# Altium project L7S_TH_Full_v1.2.PrjPcb
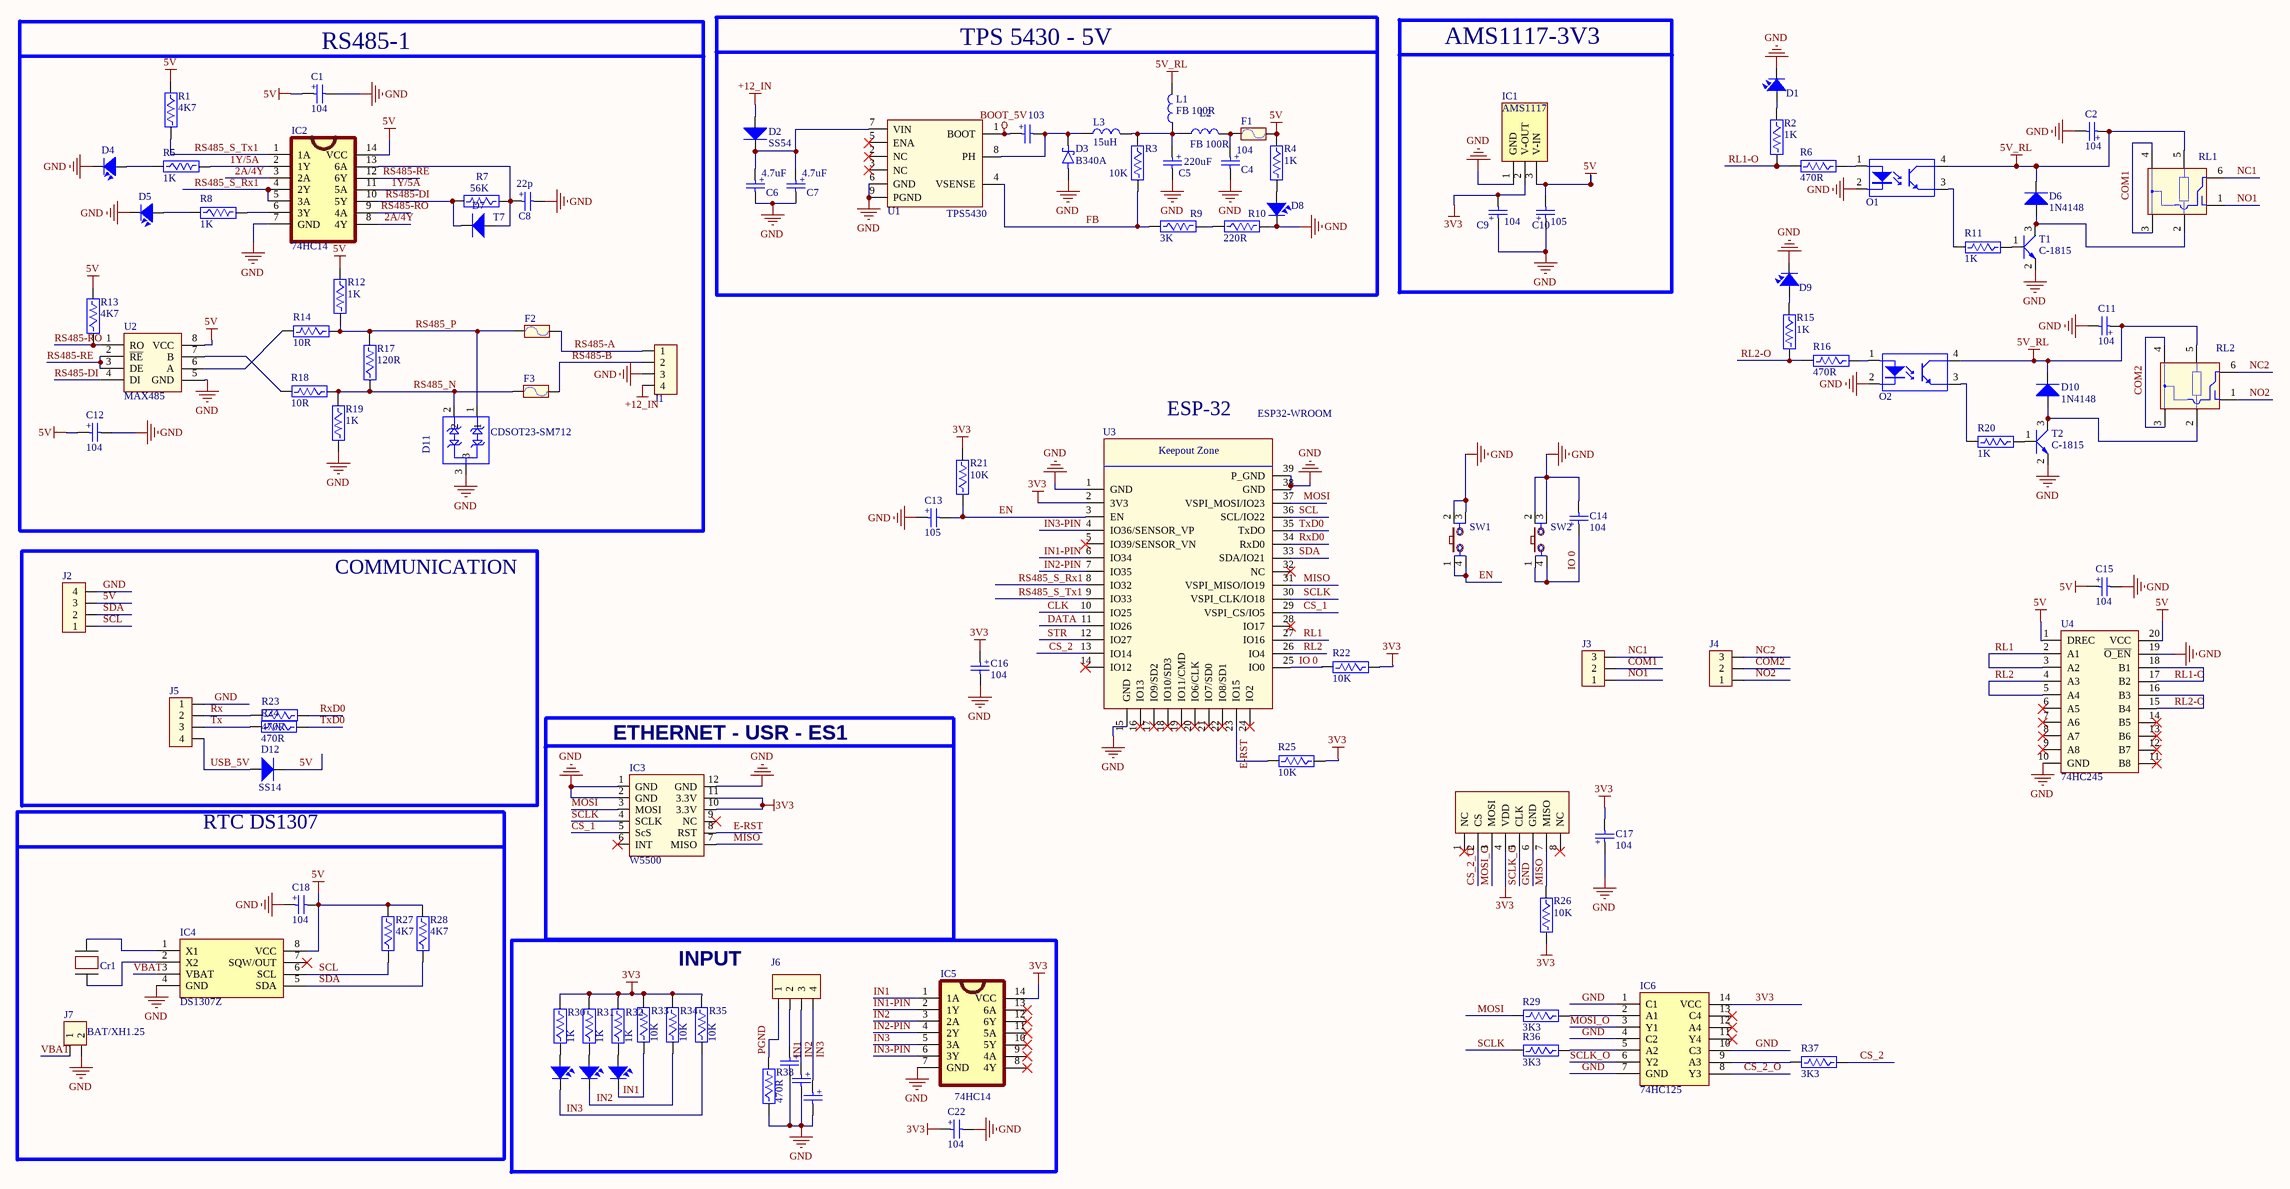
[diagram p0: Main.SchDoc]
2 sheets, 199 parts. Net scope: global (net labels, ports and power ports of the same name join across sheets).
Board file: L7S_TH_Full.PcbDoc
Sheets:
  Main.SchDoc
  LED.SchDoc

## Sheet Main.SchDoc
size A2; DocumentNumber: 1; SheetNumber: 1; SheetTotal: 2; Organization: Công ty cổ phần giải pháp và thiết bị VHB Việt Nam; Address1: KDT Dương Nội, Hà Đông, Hà Nội; SPICEModelCache: <root> / <DocumentId>GUMLTXHH</DocumentId> / </root>

### Parts
C1  104  [CAP 0805]
C2  104  [CAP 0805]
C3  103  [CAP 0805]
C4  104  [CAP 0805]
C5  220uF  [Capacitor 6x11]
C6  4.7uF  [CAP 0805]
C7  4.7uF  [CAP 0805]
C8  22p  [CAP 0805]
C9  104  [CAP 0805]
C10  105  [CAP 0805]
C11  104  [CAP 0805]
C12  104  [CAP 0805]
C13  105  [CAP 0805]
C14  104  [CAP 0805]
C15  104  [CAP 0805]
C16  104  [CAP 0805]
C17  104  [CAP 0805]
C18  104  [CAP 0805]
C19  104  [CAP 0805]  (value not drawn)
C20  104  [CAP 0805]  (value not drawn)
C21  104  [CAP 0805]  (value not drawn)
C22  104  [CAP 0805]
Cr1  FC135  [FC135327680KAAG0]  (value not drawn)
D1  LED RED 0805  [LED SMD 0805]  (value not drawn)
D2  SS54  [Diode SMB]
D3  B340A  [Diode Schotky]
D4  LED RED 0805  [LED SMD 0805]  (value not drawn)
D5  LED RED 0805  [LED SMD 0805]  (value not drawn)
D6  1N4148  [1N4848]
D7  T7  [Diode SMD]
D8  LED RED 0805  [LED SMD 0805]  (value not drawn)
D9  LED RED 0805  [LED SMD 0805]  (value not drawn)
D10  1N4148  [1N4848]
D11  M1_VALUE: CDSOT23-SM712  [SOT-23-3]  (hidden comment: SM712)
D12  SS14  [Diode SMB]
D13  LED RED 0805  [LED SMD 0805]  (value not drawn)
D14  LED RED 0805  [LED SMD 0805]  (value not drawn)
D15  LED RED 0805  [LED SMD 0805]  (value not drawn)
F1  Fuse 1812/6V  [fuse 1812]  (value not drawn)
F2  Fuse 0805/15V  [Fuse-0805]  (value not drawn)
F3  Fuse 0805/15V  [Fuse-0805]  (value not drawn)
IC1  ASM1117/3V3  [ASM1117]  (value not drawn)
IC2  74HC14  [SOP14]
IC3  W5500  [W5500-USR-ES1]
IC4  DS1307Z  [SOIC127P600X175-8N]
IC5  74HC14  [SOP14]
IC6  74HC125  [SOP65P640X120-14N]
J1  KF128-5.08-4P  [CON 4 KF128 5.08]  (value not drawn)
J2  XH2.54-4P-C  [XH-2.54 4P-T]  (value not drawn)
J3  KF128 5.08-3P  [CON KF128-3P]  (value not drawn)
J4  KF128 5.08-3P  [CON KF128-3P]  (value not drawn)
J5  XH2.54-4P-C  [XH-2.54 4P-C]  (value not drawn)
J6  KF128-5.08-4P  [CON 4 KF128 5.08]  (value not drawn)
J7  BAT/XH1.25  [Header 1.25]
L1  FB 100R  [L-Inductor 0805]
L2  FB 100R  [L-Inductor 0805]
L3  15uH  [Inductor CD75]
Mini_SDCard1  SD?  [Mini SDCard]  (value not drawn)
O1  EL3H7  [SOIC127P700X200-4N]  (value not drawn)
O2  EL3H7  [SOIC127P700X200-4N]  (value not drawn)
R1  4K7  [Res 0805]
R2  1K  [Res 0805]
R3  10K  [Res 0805]
R4  1K  [Res 0805]
R5  1K  [Res 0805]
R6  470R  [Res 0805]
R7  56K  [Res 0805]
R8  1K  [Res 0805]
R9  3K  [Res 0805]
R10  220R  [Res 0805]
R11  1K  [Res 0805]
R12  1K  [Res 0805]
R13  4K7  [Res 0805]
R14  10R  [Res 0805]
R15  1K  [Res 0805]
R16  470R  [Res 0805]
R17  120R  [Res 0805]
R18  10R  [Res 0805]
R19  1K  [Res 0805]
R20  1K  [Res 0805]
R21  10K  [Res 0805]
R22  10K  [Res 0805]
R23  470R  [Res 0805]
R24  470R  [Res 0805]
R25  10K  [Res 0805]
R26  10K  [Res 0805]
R27  4K7  [Res 0805]
R28  4K7  [Res 0805]
R29  3K3  [Res 0805]
R30  1K  [Res 0805]
R31  1K  [Res 0805]
R32  1K  [Res 0805]
R33  10K  [Res 0805]
R34  10K  [Res 0805]
R35  10K  [Res 0805]
R36  3K3  [Res 0805]
R37  3K3  [Res 0805]
R38  470R  [Res 0805]
RL1  Relay-HK4100F/12V  [HK4100FDC5VSHG]  (value not drawn)
RL2  Relay-HK4100F/12V  [HK4100FDC5VSHG]  (value not drawn)
SW1  SW  [SW2-SMD]  (value not drawn)
SW2  SW  [SW2-SMD]  (value not drawn)
T1  C-1815  [SOT23]
T2  C-1815  [SOT23]
U1  TPS5430  [SOIC127P600X170-9N]
U2  MAX485  [MAX485  SOP8]
U3  ESP32-WROOM  [ESP32WROOM32UEM113EH2800UH3Q0]
U4  74HC245  [74HC245-TSSOP20-4.4mm]

### Blocks framed on the sheet
RS485-1: C1 C8 C12 D4 D5 D7 D11 F2 F3 IC2 J1 R1 R5 R7 R8 R12-R14 R17-R19 U2
TPS 5430 - 5V: C3-C7 D2 D3 D8 F1 L1-L3 R3 R4 R9 R10 U1
AMS1117-3V3: C9 C10 IC1
COMMUNICATION: D12 J2 J5 R23 R24
ETHERNET - USR - ES1: IC3
RTC DS1307: C18 Cr1 IC4 J7 R27 R28
INPUT: C19-C22 D13-D15 IC5 J6 R30-R35 R38

### Nets
3V3: C9.2 C16.1 C17.2 C22.1 IC1.2(V-OUT) IC3.10(3.3V) IC3.11(3.3V) IC5.14(VCC) IC6.14(VCC) Mini_SDCard1.4(VDD) R21.2 R22.1 R25.1 R26.2 R30.2 R31.2 R32.2 R33.2 R34.2 R35.2 U3.2(3V3)
5V: C1.1 C10.2 C12.1 C15.1 C18.2 D12.2(K) F1.2 IC1.3(V-IN) IC2.14(VCC) IC4.8(VCC) J2.3 R1.1 R4.1 R12.1 R13.2 R27.2 R28.2 U2.8(VCC) U4.1(DREC) U4.20(VCC)
5V_RL: C2.1 C11.1 D6.K D10.K L1.2 O1.4(C) O2.4(C) RL1.5(COIL2) RL2.5(COIL2)
+12_IN: D2.1(A) J1.4
BOOT_5V: C3.1 U1.1(BOOT)
GND: C1.2 C2.2 C4.2 C5.2 C6.2 C7.2 C8.2 C9.1 C10.1 C11.2 C12.2 C13.1 C14.2 C15.2 C16.2 C17.1 C18.1 C19.2 C20.2 C21.2 C22.2 D1.2 D3.A D4.2 D5.2 D8.2 D9.2 D11.3 IC1.1(GND) IC2.7(GND) IC3.1(GND) IC3.2(GND) IC3.12(GND) IC4.4(GND) IC5.7(GND) IC6.1(C1) IC6.4(C2) IC6.7(GND) IC6.10(C3) J1.3 J2.4 J5.1 J7.2 Mini_SDCard1.6(GND) O1.2(K) O2.2(K) R10.2 R19.2 R38.1 SW1.2 SW1.3 SW2.2 SW2.3 T1.2(E) T2.2(E) U1.6(GND) U1.9(PGND) U2.5(GND) U3.1(GND) U3.15(GND) U3.38(GND) U3.39(P_GND) U4.10(GND) U4.19(~{O_EN})
1Y/5A: IC2.2(1Y) IC2.11(5A) R5.2
2A/4Y: IC2.3(2A) IC2.8(4Y)
CLK: U3.10(IO25)
COM1: J3.2 RL1.3(COM) RL1.4(COM)
COM2: J4.2 RL2.3(COM) RL2.4(COM)
CS_1: IC3.5(ScS) U3.29(VSPI_CS/IO5)
CS_2: R37.1 U3.13(IO14)
CS_2_O: IC6.8(Y3) Mini_SDCard1.2(CS)
DATA: U3.11(IO26)
E-RST: IC3.8(RST) R25.2 U3.23(IO15)
EN: C13.2 R21.1 SW1.1 SW1.4 U3.3(EN)
FB: R3.2 R9.1 U1.4(VSENSE)
IN1: C19.1 D15.2 IC5.1(1A) J6.2 R33.1
IN1-PIN: IC5.2(1Y) U3.6(IO34)
IN2: C20.1 D14.2 IC5.3(2A) J6.3 R34.1
IN2-PIN: IC5.4(2Y) U3.7(IO35)
IN3: C21.1 D13.2 IC5.5(3A) J6.4 R35.1
IN3-PIN: IC5.6(3Y) U3.4(IO36/SENSOR_VP)
IO 0: C14.1 R22.2 SW2.1 SW2.4 U3.25(IO0)
MISO: IC3.7(MISO) Mini_SDCard1.7(MISO) R26.1 U3.31(VSPI_MISO/IO19)
MOSI: IC3.3(MOSI) R29.2 U3.37(VSPI_MOSI/IO23)
MOSI_O: IC6.3(Y1) Mini_SDCard1.3(MOSI)
NC1: J3.3 RL1.6(NO)
NC2: J4.3 RL2.6(NO)
NO1: J3.1 RL1.1(NC)
NO2: J4.1 RL2.1(NC)
PGND: J6.1 R38.2
RL1: U3.27(IO16) U4.2(A1) U4.3(A2)
RL1-O: R2.2 R6.2 U4.17(B2) U4.18(B1)
RL2: U3.26(IO4) U4.4(A3) U4.5(A4)
RL2-O: R15.2 R16.2 U4.15(B4) U4.16(B3)
RS485-A: F2.2 J1.1
RS485-B: F3.2 J1.2
RS485-DI: D7.2(K) IC2.10(5Y) R7.2 U2.4(DI)
RS485-RE: IC2.12(6Y) U2.2(~{RE}) U2.3(DE)
RS485-RO: IC2.9(4A) R13.1 U2.1(RO)
RS485_N: D11.2 F3.1 R17.1 R18.1 R19.1
RS485_P: D11.1 F2.1 R12.2 R14.1 R17.2
RS485_S_Rx1: IC2.4(2Y) IC2.5(3A) U3.8(IO32)
RS485_S_Tx1: IC2.1(1A) R1.2 U3.9(IO33)
Rx: J5.2 R23.2
RxD0: R23.1 U3.34(RxD0)
SCL: IC4.6(SCL) J2.1 R27.1 U3.36(SCL/IO22)
SCLK: IC3.4(SCLK) R36.2 U3.30(VSPI_CLK/IO18)
SCLK_O: IC6.6(Y2) Mini_SDCard1.5(CLK)
SDA: IC4.5(SDA) J2.2 R28.1 U3.33(SDA/IO21)
STR: U3.12(IO27)
Tx: J5.3 R24.2
TxD0: R24.1 U3.35(TxDO)
USB_5V: D12.1(A) J5.4
VBAT: IC4.3(VBAT) J7.1
NetC3_2: C3.2 D3.K L3.1 U1.8(PH)
NetC4_1: C4.1 F1.1 L2.2
NetC5_1: C5.1 L1.1 L2.1 L3.2 R3.1
NetC6_1: C6.1 C7.1 D2.2(K) U1.7(VIN)
NetC8_1: C8.1 D7.1(A) IC2.13(6A) R7.1
NetCr1_1: Cr1.1 IC4.2(X2)
NetCr1_2: Cr1.2 IC4.1(X1)
NetD1_1: D1.1 R2.1
NetD4_1: D4.1 R5.1
NetD5_1: D5.1 R8.1
NetD6_A: D6.A RL1.2(COIL1) T1.3(C)
NetD8_1: D8.1 R4.2
NetD9_1: D9.1 R15.1
NetD10_A: D10.A RL2.2(COIL1) T2.3(C)
NetD13_1: D13.1 R30.1
NetD14_1: D14.1 R31.1
NetD15_1: D15.1 R32.1
NetIC2_6: IC2.6(3Y) R8.2
NetIC6_2: IC6.2(A1) R29.1
NetIC6_5: IC6.5(A2) R36.1
NetIC6_9: IC6.9(A3) R37.2
NetO1_1: O1.1(A) R6.1
NetO1_3: O1.3(E) R11.2
NetO2_1: O2.1(A) R16.1
NetO2_3: O2.3(E) R20.2
NetR9_2: R9.2 R10.1
NetR11_1: R11.1 T1.1(B)
NetR14_2: R14.2 U2.6(A)
NetR18_2: R18.2 U2.7(B)
NetR20_1: R20.1 T2.1(B)

Not connected (* = marked no-connect by the designer): IC3 6(INT)* 9(NC)*; IC4 7(SQW/OUT)*; IC5 8(4Y)* 9(4A)* 10(5Y)* 11(5A)* 12(6Y)* 13(6A)*; IC6 11(Y4)* 12(A4)* 13(C4)*; Mini_SDCard1 1(NC)* 8(NC)*; U1 2(NC)* 3(NC)* 5(ENA)*; U3 5(IO39/SENSOR_VN)* 14(IO12)* 16(IO13)* 17(IO9/SD2)* 18(IO10/SD3)* 19(IO11/CMD)* 20(IO6/CLK)* 21(IO7/SD0)* 22(IO8/SD1)* 24(IO2)* 28(IO17)* 32(NC)*; U4 6(A5)* 7(A6)* 8(A7)* 9(A8)* 11(B8)* 12(B7)* 13(B6)* 14(B5)*

### Notes on the sheet
- ESP-32
- Project Name:
- Author:
- Checked:
- Size:
- Date:
- File:
- Sheet Name:
- A2
- Time:
- Approved:
- Rev:
- Sheet:
- of:
- (in symbol Capacitor) +
- (in symbol ESP32-WROOM) Keepout Zone

### Library data of the parts
C1-C22 = Capacitor
Cr1 = Crystal
D1 D4 D5 D8 D9 D13-D15 = Led Smd
D2 D7 D12 = Diode
D3 = Diode schottky
D11 = TVS-CDSOT23-SM712: TVS-DIODE;BIR-DIR,DUAL,400W,7.5V,SOT23,CDSOT23-SM712; M1_CATE: ESD/TVS; M1_CLASS: U3; M1_ITEM: PUR; M1_MANU1: Bourns Inc; M1_PROC: SM; M1_TYPE: TVS; M1_UNIT: PCS; PAKAGE: SOT23_N; M1_VIETTEL_CODE: 2810-000085; M1_DESC: TVS-DIODE;BIR-DIR,DUAL,400W,7.5V,SOT23,CDSOT23-SM712; M1_MANU1_PN: CDSOT23-SM712
F1-F3 = Fuse
IC1 = AMS1117
IC3 = W5500-USR-ES1
IC4 = DS1307Z: Integrated Circuit; Manufacturer_Name: Maxim Integrated; Datasheet Link: https://datasheets.maximintegrated.com/en/ds/DS1307.pdf; Height: 1.75mm; Manufacturer_Part_Number: DS1307Z; Mouser Part Number: 700-DS1307Z-NR; Mouser Price/Stock: https://www.mouser.co.uk/ProductDetail/Maxim-Integrated/DS1307Z?qs=1eQvB6Dk1vjw3IRIE9TdIQ%3D%3D
IC6 = MM74HC125MTCX: Integrated Circuit; Manufacturer_Name: onsemi; Height: 1.2mm; Manufacturer_Part_Number: MM74HC125MTCX; Mouser Part Number: 512-MM74HC125MTCX; Mouser Price/Stock: https://www.mouser.co.uk/ProductDetail/ON-Semiconductor-Fairchild/MM74HC125MTCX?qs=f8e5tgPJFBP9tH4ItwUo%252Bg%3D%3D; Arrow Part Number: MM74HC125MTCX; Arrow Price/Stock: https://www.arrow.com/en/products/mm74hc125mtcx/on-semiconductor
J1 J6 = Con4
J2 J5 = Header 4P
J3 J4 = Con3
J7 = Con2
L1-L3 = L-Inductor
Mini_SDCard1 = Mini SDCard
R1-R38 = Res
RL1 RL2 = Relay-HK4100F: ComponentLink1Description: Datasheet; ComponentLink1URL: https://www.snapeda.com/parts/HK4100F-DC5V-SHG/HUIKE/datasheet/
SW1 SW2 = SW4: Switch button 4 pin; Value: Button chip 4 pin
T1 T2 = Tranzitor
D6 D10 = 1N4148: ComponentLink1Description: Datasheet; ComponentLink1URL: https://www.vishay.com/docs/85557/ll4148.pdf
IC2 = 74HC14: ComponentLink1Description: Datasheet; ComponentLink1URL: https://www.mouser.com/datasheet/2/308/74HC14.REV1-34947.pdf
U1 = TPS5430: ComponentLink1Description: Datasheet; ComponentLink1URL: https://www.ti.com/lit/ds/symlink/tps5430.pdf?ts=1670776849209
U3 = ESP32-WROOM: ComponentLink1Description: Datasheet1; ComponentLink1URL: https://www.espressif.com/sites/default/files/documentation/esp32-wroom-32_datasheet_en.pdf; ComponentLink2Description: Datasheet2; ComponentLink2URL: https://cdn.sparkfun.com/datasheets/IoT/esp32_datasheet_en.pdf
U4 = 74HC245: ComponentLink1Description: Datasheet; ComponentLink1URL: https://www.mouser.com/datasheet/2/308/74HC245.REV1-69988.pdf

## Sheet LED.SchDoc: LED
size A3; DocumentNumber: 1; Revision: 1.0; SheetNumber: 2; SheetTotal: 2; Organization: Công ty cổ phần giải pháp và thiêt bị VHB Việt Nam; Address1: KDT Dương Nội, Hà Đông, Hà Nội
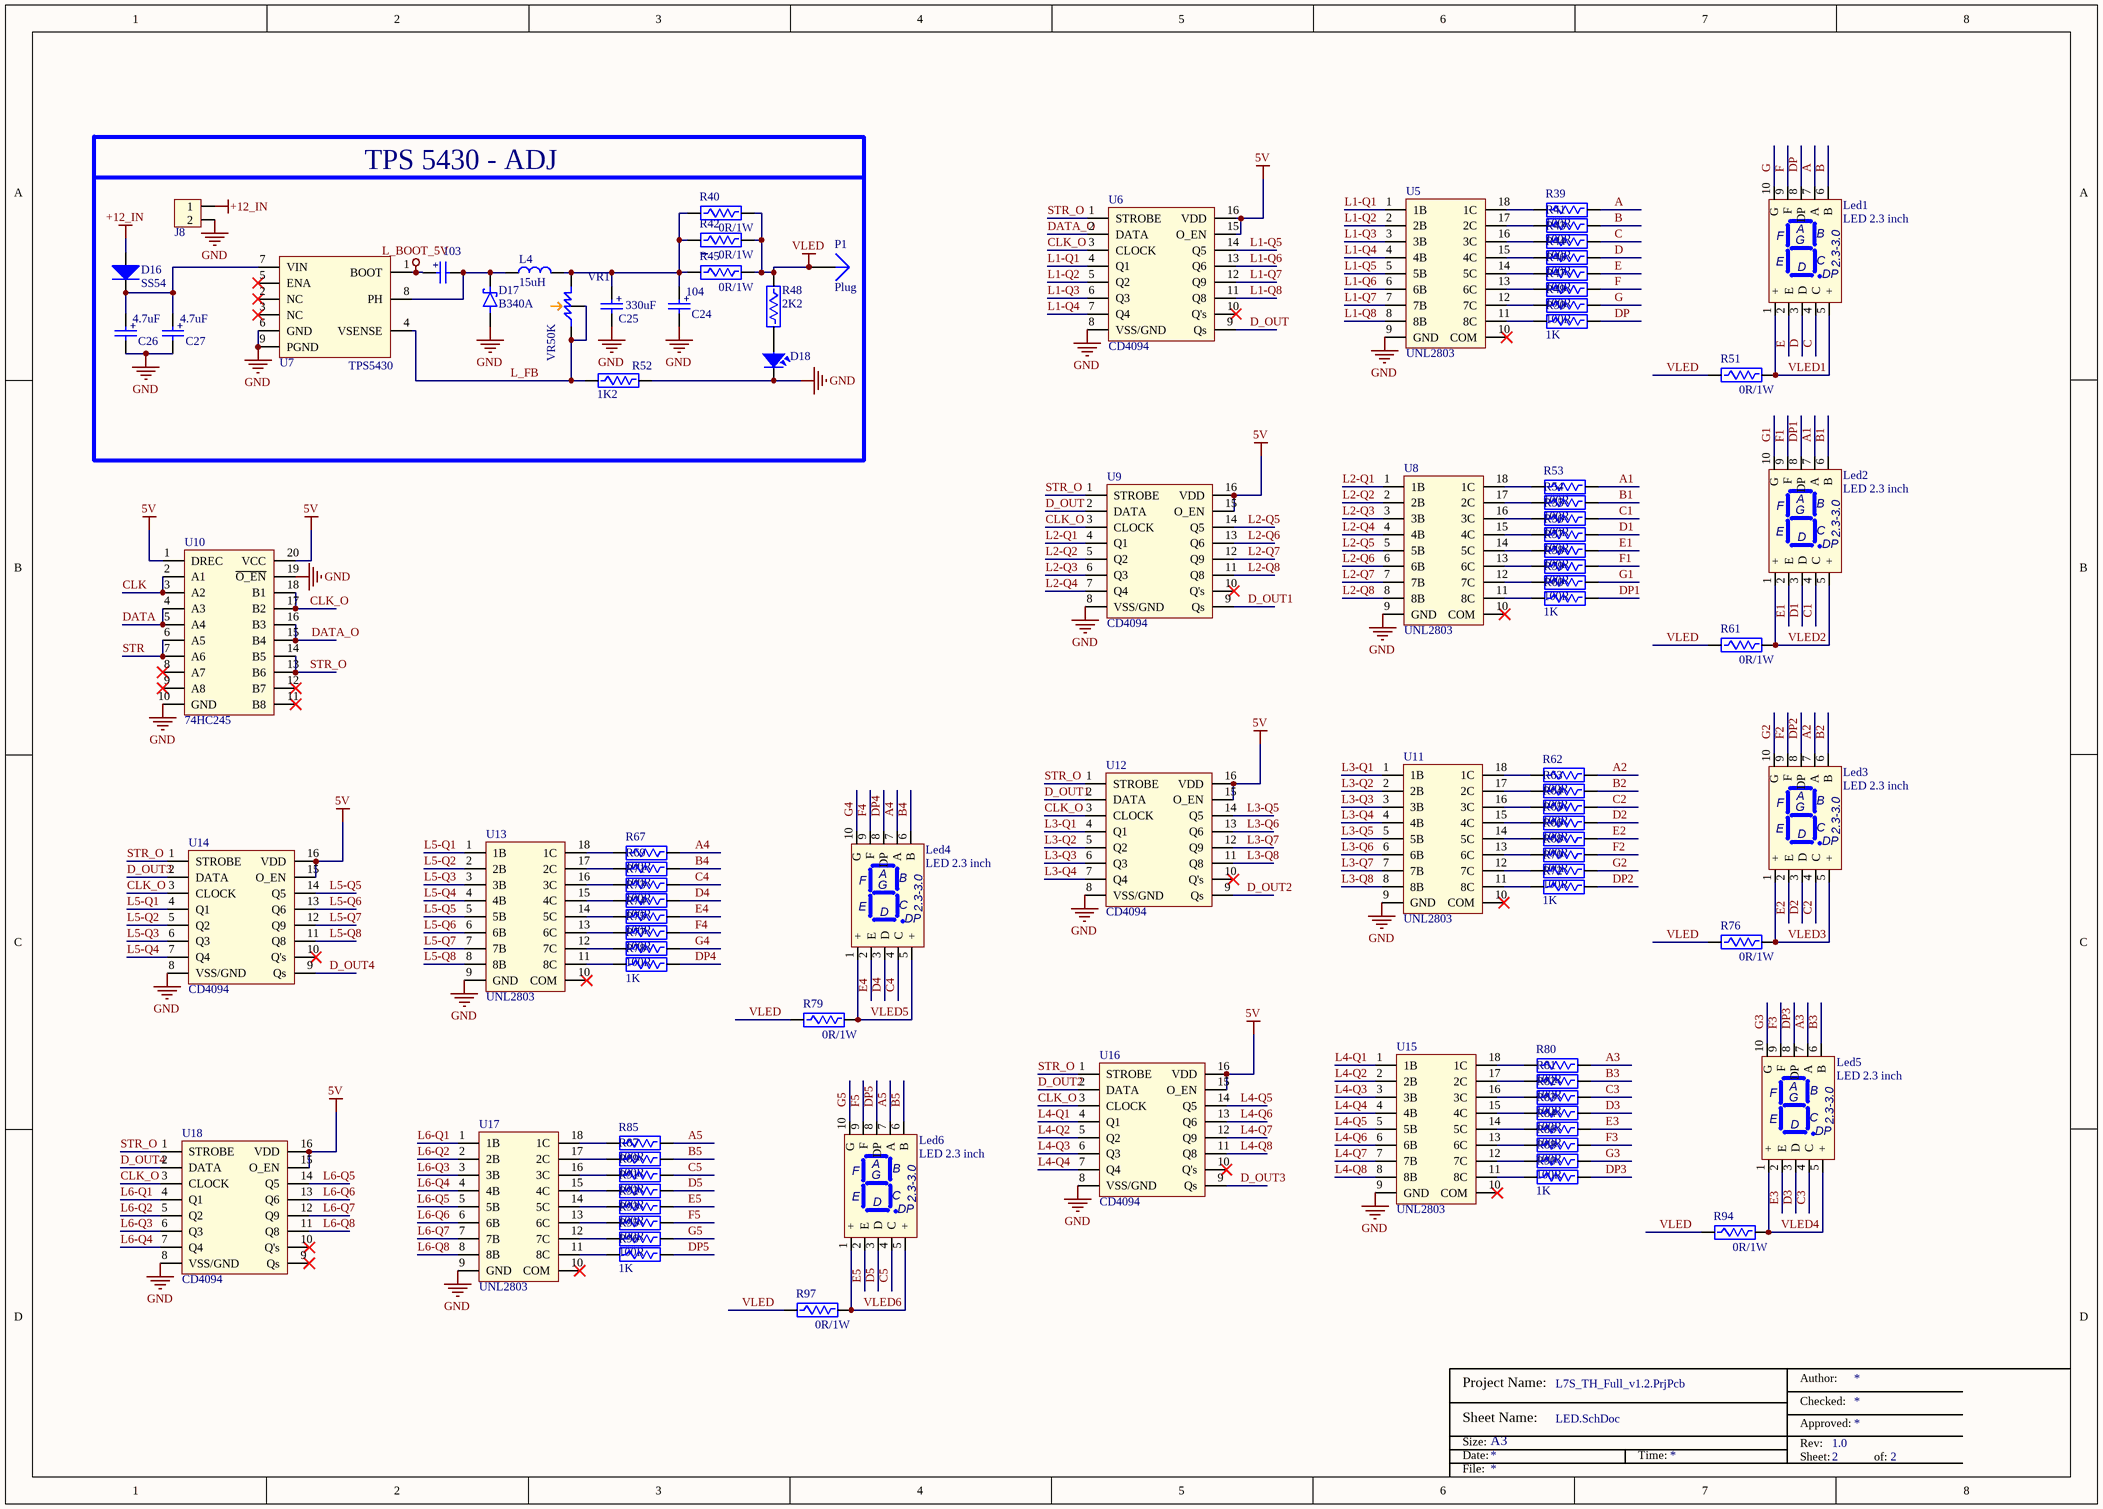
[diagram p1: LED.SchDoc]

### Parts
C23  103  [CAP 0805]
C24  104  [CAP 0805]
C25  330uF  [Capacitor 6x11]
C26  4.7uF  [CAP 0805]
C27  4.7uF  [CAP 0805]
D16  SS54  [Diode SMB]
D17  B340A  [Diode Schotky]
D18  LED RED 0805  [LED SMD 0805]  (value not drawn)
J8  KF128-5.08-2P  [CON KF128-2P]  (value not drawn)
L4  15uH  [Inductor CD75]
Led1  LED 2.3 inch  [LED7SEG 2.3 inch]
Led2  LED 2.3 inch  [LED7SEG 2.3 inch]
Led3  LED 2.3 inch  [LED7SEG 2.3 inch]
Led4  LED 2.3 inch  [LED7SEG 2.3 inch]
Led5  LED 2.3 inch  [LED7SEG 2.3 inch]
Led6  LED 2.3 inch  [LED7SEG 2.3 inch]
P1  Plug  [PIN1]
R39  100R  [Res 0805]
R40  0R/1W  [RES 2512]
R41  100R  [Res 0805]
R42  0R/1W  [RES 2512]
R43  100R  [Res 0805]
R44  100R  [Res 0805]
R45  0R/1W  [RES 2512]
R46  100R  [Res 0805]
R47  100R  [Res 0805]
R48  2K2  [Res 0805]
R49  100R  [Res 0805]
R50  1K  [Res 0805]
R51  0R/1W  [RES 2512]
R52  1K2  [Res 0805]
R53  100R  [Res 0805]
R54  100R  [Res 0805]
R55  100R  [Res 0805]
R56  100R  [Res 0805]
R57  100R  [Res 0805]
R58  100R  [Res 0805]
R59  100R  [Res 0805]
R60  1K  [Res 0805]
R61  0R/1W  [RES 2512]
R62  100R  [Res 0805]
R63  100R  [Res 0805]
R64  100R  [Res 0805]
R65  100R  [Res 0805]
R66  100R  [Res 0805]
R67  100R  [Res 0805]
R68  100R  [Res 0805]
R69  100R  [Res 0805]
R70  100R  [Res 0805]
R71  100R  [Res 0805]
R72  1K  [Res 0805]
R73  100R  [Res 0805]
R74  100R  [Res 0805]
R75  100R  [Res 0805]
R76  0R/1W  [RES 2512]
R77  100R  [Res 0805]
R78  1K  [Res 0805]
R79  0R/1W  [RES 2512]
R80  100R  [Res 0805]
R81  100R  [Res 0805]
R82  100R  [Res 0805]
R83  100R  [Res 0805]
R84  100R  [Res 0805]
R85  100R  [Res 0805]
R86  100R  [Res 0805]
R87  100R  [Res 0805]
R88  100R  [Res 0805]
R89  100R  [Res 0805]
R90  1K  [Res 0805]
R91  100R  [Res 0805]
R92  100R  [Res 0805]
R93  100R  [Res 0805]
R94  0R/1W  [RES 2512]
R95  100R  [Res 0805]
R96  1K  [Res 0805]
R97  0R/1W  [RES 2512]
U5  UNL2803  [UNL2803A]
U6  CD4094  [CD4094]
U7  TPS5430  [SOIC127P600X170-9N]
U8  UNL2803  [UNL2803A]
U9  CD4094  [CD4094]
U10  74HC245  [74HC245-TSSOP20-4.4mm]
U11  UNL2803  [UNL2803A]
U12  CD4094  [CD4094]
U13  UNL2803  [UNL2803A]
U14  CD4094  [CD4094]
U15  UNL2803  [UNL2803A]
U16  CD4094  [CD4094]
U17  UNL2803  [UNL2803A]
U18  CD4094  [CD4094]
VR1  VR50K  [VR 3296W]

### Blocks framed on the sheet
TPS 5430 - ADJ: C23-C27 D16-D18 J8 L4 P1 R40 R42 R45 R48 R52 U7 VR1

### Nets
5V: U6.15(O_EN) U6.16(VDD) U9.15(O_EN) U9.16(VDD) U10.1(DREC) U10.20(VCC) U12.15(O_EN) U12.16(VDD) U14.15(O_EN) U14.16(VDD) U16.15(O_EN) U16.16(VDD) U18.15(O_EN) U18.16(VDD)
+12_IN: D16.1(A) J8.1
GND: C24.2 C25.2 C26.2 C27.2 D17.A D18.2 J8.2 R52.2 U5.9(GND) U6.8(VSS/GND) U7.6(GND) U7.9(PGND) U8.9(GND) U9.8(VSS/GND) U10.10(GND) U10.19(~{O_EN}) U11.9(GND) U12.8(VSS/GND) U13.9(GND) U14.8(VSS/GND) U15.9(GND) U16.8(VSS/GND) U17.9(GND) U18.8(VSS/GND)
L_BOOT_5V: C23.1 U7.1(BOOT)
VLED: P1.1 R40.2 R42.2 R45.2 R48.1 R51.1 R61.1 R76.1 R79.1 R94.1 R97.1
A: Led1.7(A) R39.2
A1: Led2.7(A) R53.2
A2: Led3.7(A) R62.2
A3: Led5.7(A) R80.2
A4: Led4.7(A) R67.2
A5: Led6.7(A) R85.2
B: Led1.6(B) R41.2
B1: Led2.6(B) R54.2
B2: Led3.6(B) R63.2
B3: Led5.6(B) R81.2
B4: Led4.6(B) R69.2
B5: Led6.6(B) R87.2
C: Led1.4(C) R43.2
C1: Led2.4(C) R55.2
C2: Led3.4(C) R64.2
C3: Led5.4(C) R82.2
C4: Led4.4(C) R71.2
C5: Led6.4(C) R89.2
CLK: U10.2(A1) U10.3(A2)
CLK_O: U6.3(CLOCK) U9.3(CLOCK) U10.17(B2) U10.18(B1) U12.3(CLOCK) U14.3(CLOCK) U16.3(CLOCK) U18.3(CLOCK)
D: Led1.3(D) R44.2
D1: Led2.3(D) R56.2
D2: Led3.3(D) R65.2
D3: Led5.3(D) R83.2
D4: Led4.3(D) R73.2
D5: Led6.3(D) R91.2
D_OUT: U6.9(Qs) U9.2(DATA)
D_OUT1: U9.9(Qs) U12.2(DATA)
D_OUT2: U12.9(Qs) U16.2(DATA)
D_OUT3: U14.2(DATA) U16.9(Qs)
D_OUT4: U14.9(Qs) U18.2(DATA)
DATA: U10.4(A3) U10.5(A4)
DATA_O: U6.2(DATA) U10.15(B4) U10.16(B3)
DP: Led1.8(DP) R50.2
DP1: Led2.8(DP) R60.2
DP2: Led3.8(DP) R72.2
DP3: Led5.8(DP) R90.2
DP4: Led4.8(DP) R78.2
DP5: Led6.8(DP) R96.2
E: Led1.2(E) R46.2
E1: Led2.2(E) R57.2
E2: Led3.2(E) R66.2
E3: Led5.2(E) R84.2
E4: Led4.2(E) R74.2
E5: Led6.2(E) R92.2
F: Led1.9(F) R47.2
F1: Led2.9(F) R58.2
F2: Led3.9(F) R68.2
F3: Led5.9(F) R86.2
F4: Led4.9(F) R75.2
F5: Led6.9(F) R93.2
G: Led1.10(G) R49.2
G1: Led2.10(G) R59.2
G2: Led3.10(G) R70.2
G3: Led5.10(G) R88.2
G4: Led4.10(G) R77.2
G5: Led6.10(G) R95.2
L1-Q1: U5.1(1B) U6.4(Q1)
L1-Q2: U5.2(2B) U6.5(Q2)
L1-Q3: U5.3(3B) U6.6(Q3)
L1-Q4: U5.4(4B) U6.7(Q4)
L1-Q5: U5.5(5B) U6.14(Q5)
L1-Q6: U5.6(6B) U6.13(Q6)
L1-Q7: U5.7(7B) U6.12(Q9)
L1-Q8: U5.8(8B) U6.11(Q8)
L2-Q1: U8.1(1B) U9.4(Q1)
L2-Q2: U8.2(2B) U9.5(Q2)
L2-Q3: U8.3(3B) U9.6(Q3)
L2-Q4: U8.4(4B) U9.7(Q4)
L2-Q5: U8.5(5B) U9.14(Q5)
L2-Q6: U8.6(6B) U9.13(Q6)
L2-Q7: U8.7(7B) U9.12(Q9)
L2-Q8: U8.8(8B) U9.11(Q8)
L3-Q1: U11.1(1B) U12.4(Q1)
L3-Q2: U11.2(2B) U12.5(Q2)
L3-Q3: U11.3(3B) U12.6(Q3)
L3-Q4: U11.4(4B) U12.7(Q4)
L3-Q5: U11.5(5B) U12.14(Q5)
L3-Q6: U11.6(6B) U12.13(Q6)
L3-Q7: U11.7(7B) U12.12(Q9)
L3-Q8: U11.8(8B) U12.11(Q8)
L4-Q1: U15.1(1B) U16.4(Q1)
L4-Q2: U15.2(2B) U16.5(Q2)
L4-Q3: U15.3(3B) U16.6(Q3)
L4-Q4: U15.4(4B) U16.7(Q4)
L4-Q5: U15.5(5B) U16.14(Q5)
L4-Q6: U15.6(6B) U16.13(Q6)
L4-Q7: U15.7(7B) U16.12(Q9)
L4-Q8: U15.8(8B) U16.11(Q8)
L5-Q1: U13.1(1B) U14.4(Q1)
L5-Q2: U13.2(2B) U14.5(Q2)
L5-Q3: U13.3(3B) U14.6(Q3)
L5-Q4: U13.4(4B) U14.7(Q4)
L5-Q5: U13.5(5B) U14.14(Q5)
L5-Q6: U13.6(6B) U14.13(Q6)
L5-Q7: U13.7(7B) U14.12(Q9)
L5-Q8: U13.8(8B) U14.11(Q8)
L6-Q1: U17.1(1B) U18.4(Q1)
L6-Q2: U17.2(2B) U18.5(Q2)
L6-Q3: U17.3(3B) U18.6(Q3)
L6-Q4: U17.4(4B) U18.7(Q4)
L6-Q5: U17.5(5B) U18.14(Q5)
L6-Q6: U17.6(6B) U18.13(Q6)
L6-Q7: U17.7(7B) U18.12(Q9)
L6-Q8: U17.8(8B) U18.11(Q8)
L_FB: R52.1 U7.4(VSENSE) VR1.1 VR1.2
STR: U10.6(A5) U10.7(A6)
STR_O: U6.1(STROBE) U9.1(STROBE) U10.13(B6) U10.14(B5) U12.1(STROBE) U14.1(STROBE) U16.1(STROBE) U18.1(STROBE)
VLED1: Led1.1(+) Led1.5(+) R51.2
VLED2: Led2.1(+) Led2.5(+) R61.2
VLED3: Led3.1(+) Led3.5(+) R76.2
VLED4: Led5.1(+) Led5.5(+) R94.2
VLED5: Led4.1(+) Led4.5(+) R79.2
VLED6: Led6.1(+) Led6.5(+) R97.2
NetC23_2: C23.2 D17.K L4.1 U7.8(PH)
NetC24_1: C24.1 C25.1 L4.2 R40.1 R42.1 R45.1 VR1.3
NetC26_1: C26.1 C27.1 D16.2(K) U7.7(VIN)
NetD18_1: D18.1 R48.2
NetR39_1: R39.1 U5.18(1C)
NetR41_1: R41.1 U5.17(2C)
NetR43_1: R43.1 U5.16(3C)
NetR44_1: R44.1 U5.15(4C)
NetR46_1: R46.1 U5.14(5C)
NetR47_1: R47.1 U5.13(6C)
NetR49_1: R49.1 U5.12(7C)
NetR50_1: R50.1 U5.11(8C)
NetR53_1: R53.1 U8.18(1C)
NetR54_1: R54.1 U8.17(2C)
NetR55_1: R55.1 U8.16(3C)
NetR56_1: R56.1 U8.15(4C)
NetR57_1: R57.1 U8.14(5C)
NetR58_1: R58.1 U8.13(6C)
NetR59_1: R59.1 U8.12(7C)
NetR60_1: R60.1 U8.11(8C)
NetR62_1: R62.1 U11.18(1C)
NetR63_1: R63.1 U11.17(2C)
NetR64_1: R64.1 U11.16(3C)
NetR65_1: R65.1 U11.15(4C)
NetR66_1: R66.1 U11.14(5C)
NetR67_1: R67.1 U13.18(1C)
NetR68_1: R68.1 U11.13(6C)
NetR69_1: R69.1 U13.17(2C)
NetR70_1: R70.1 U11.12(7C)
NetR71_1: R71.1 U13.16(3C)
NetR72_1: R72.1 U11.11(8C)
NetR73_1: R73.1 U13.15(4C)
NetR74_1: R74.1 U13.14(5C)
NetR75_1: R75.1 U13.13(6C)
NetR77_1: R77.1 U13.12(7C)
NetR78_1: R78.1 U13.11(8C)
NetR80_1: R80.1 U15.18(1C)
NetR81_1: R81.1 U15.17(2C)
NetR82_1: R82.1 U15.16(3C)
NetR83_1: R83.1 U15.15(4C)
NetR84_1: R84.1 U15.14(5C)
NetR85_1: R85.1 U17.18(1C)
NetR86_1: R86.1 U15.13(6C)
NetR87_1: R87.1 U17.17(2C)
NetR88_1: R88.1 U15.12(7C)
NetR89_1: R89.1 U17.16(3C)
NetR90_1: R90.1 U15.11(8C)
NetR91_1: R91.1 U17.15(4C)
NetR92_1: R92.1 U17.14(5C)
NetR93_1: R93.1 U17.13(6C)
NetR95_1: R95.1 U17.12(7C)
NetR96_1: R96.1 U17.11(8C)

Not connected (* = marked no-connect by the designer): U5 10(COM)*; U6 10(Q's)*; U7 2(NC)* 3(NC)* 5(ENA)*; U8 10(COM)*; U9 10(Q's)*; U10 8(A7)* 9(A8)* 11(B8)* 12(B7)*; U11 10(COM)*; U12 10(Q's)*; U13 10(COM)*; U14 10(Q's)*; U15 10(COM)*; U16 10(Q's)*; U17 10(COM)*; U18 9(Qs)* 10(Q's)*

### Notes on the sheet
- Project Name:
- Author:
- Size:
- Date:
- Sheet Name:
- A3
- Time:
- Checked:
- Approved:
- Rev:
- Sheet:
- of:
- File:
- (in symbol Capacitor) +
- (in symbol Led7S 2.3 - 3.0 inch) 2.3-3.0

### Library data of the parts
C23-C27 = Capacitor
D16 = Diode
D17 = Diode schottky
D18 = Led Smd
J8 = Con2
L4 = L-Inductor
Led1-Led6 = Led7S 2.3 - 3.0 inch
R39-R97 = Res
VR1 = VR 3296W
P1 = Plug: LatestRevisionDate: 17-Jul-2002; LatestRevisionNote: Re-released for DXP Platform.; Publisher: Altium Limited
U5 U8 U11 U13 U15 U17 = UNL2803: ComponentLink1Description: Datasheet; ComponentLink1URL: https://www.sparkfun.com/datasheets/IC/uln2803a.pdf
U6 U9 U12 U14 U16 U18 = CD4094: Datasheet: https://www.ti.com/lit/gpn/cd4094b; ComponentLink1Description: Datasheet 2; ComponentLink1URL: https://assets.nexperia.com/documents/data-sheet/HEF4094B.pdf
U7 = TPS5430: ComponentLink1Description: Datasheet; ComponentLink1URL: https://www.ti.com/lit/ds/symlink/tps5430.pdf?ts=1670776849209
U10 = 74HC245: ComponentLink1Description: Datasheet; ComponentLink1URL: https://www.mouser.com/datasheet/2/308/74HC245.REV1-69988.pdf

## Nets that join several sheets
5V: Main (20 pins), LED (14 pins)
+12_IN: Main (D2.1 J1.4), LED (D16.1 J8.1)
GND: Main (64 pins), LED (24 pins)
CLK: Main (U3.10), LED (U10.2 U10.3)
DATA: Main (U3.11), LED (U10.4 U10.5)
STR: Main (U3.12), LED (U10.6 U10.7)